# Altium project isolation_verifier.PrjPcb
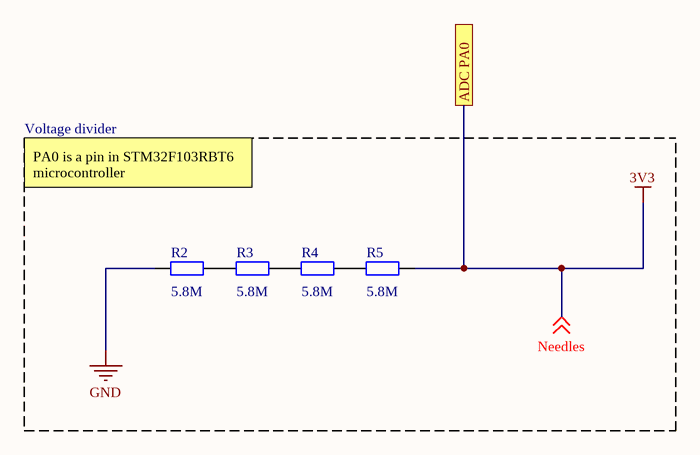
[diagram p0: isolation_verifier.SchDoc]
1 sheet, 4 parts. Net scope: flat (ports and power ports of the same name join across sheets).

## Sheet isolation_verifier.SchDoc
size A4

### Parts
R2  value 5.8M  [AXIAL-0.4]  (hidden comment: Res2)
R3  value 5.8M  [AXIAL-0.4]  (hidden comment: Res2)
R4  value 5.8M  [AXIAL-0.4]  (hidden comment: Res2)
R5  value 5.8M  [AXIAL-0.4]  (hidden comment: Res2)

### Blocks framed on the sheet
Voltage divider: R2-R5

### Ports
ADC PA0

### Nets
3V3: R5.2 ; off-sheet Needles, port ADC PA0  [also labelled Needles]
GND: R2.1
NetR2_2: R2.2 R3.1
NetR3_2: R3.2 R4.1
NetR4_2: R4.2 R5.1

### Notes on the sheet
- PA0 is a pin in STM32F103RBT6 microcontroller

### Library data of the parts
R2-R5 = Res2: Resistor; Published: 8-Jun-2000; LatestRevisionDate: 17-Jul-2002; LatestRevisionNote: Re-released for DXP Platform.; PackageReference: AXIAL-0.4; Publisher: Altium Limited; PackageDescription: Axial Device, Thru-Hole; 2 Leads; 0.4 in Pin Spacing